# EAGLE design 0125-humidity-temp-sensor (EAGLE 9.6.2)
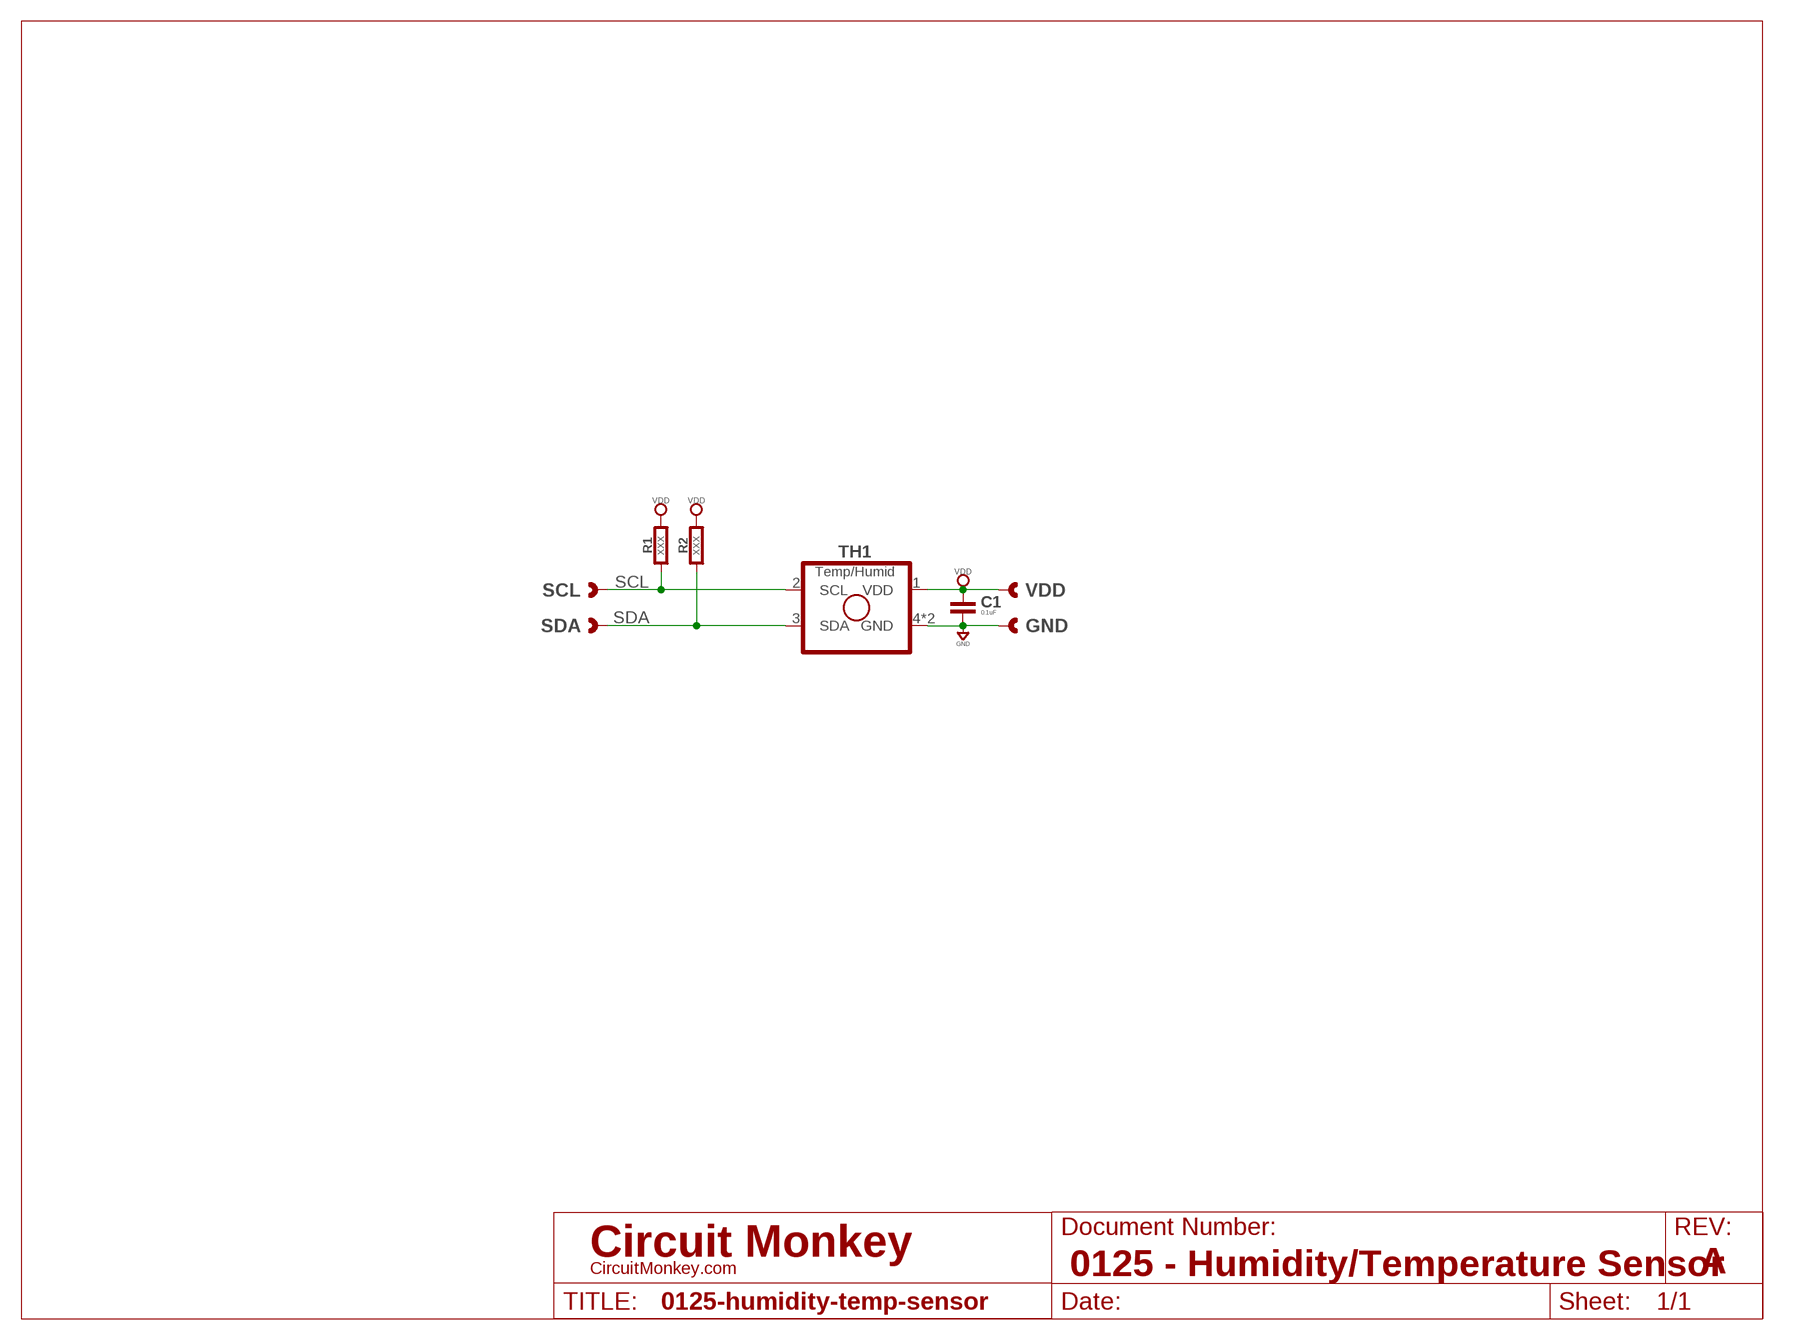
[diagram p0: schematic, sheet 1]
U$1 (LETTER_L-CIRCUITMONKEY): DOCUMENT_NUMBER: 0125 - Humidity/Temperature Sensor; REV: A

## Parts
C1  0.1uF  CAPACITOR0402  [0402-CAP]
GND  CAST-01X12.00MM  [CAST01-2.00MM]
R1  XXX  RESISTOR0402  [0402-RES]
R2  XXX  RESISTOR0402  [0402-RES]
SCL  CAST-01X12.00MM  [CAST01-2.00MM]
SDA  CAST-01X12.00MM  [CAST01-2.00MM]
TH1  Temp/Humid  I2C-SHTC3  [SHTC3]
VDD  CAST-01X12.00MM  [CAST01-2.00MM]

## Nets
GND: C1.2 GND.1 GND.P$1 GND.P$2 TH1.4(GND) TH1.PAD(GND)
SCL: R1.1 SCL.1 SCL.P$1 SCL.P$2 TH1.2(SCL)
SDA: R2.1 SDA.1 SDA.P$1 SDA.P$2 TH1.3(SDA)
VDD: C1.1 R1.2 R2.2 TH1.1(VDD) VDD.1 VDD.P$1 VDD.P$2

## Library data of the parts
C1 = rlc:CAPACITOR: Capacitor; COST01: 0.12; COST10: 0.09; COST100: 0.04
GND SCL SDA VDD = con-headers:CAST-01X1: Castelated Edge Hole Pad
R1 R2 = rlc:RESISTOR: Resistor; COST01: 0.10; COST10: 0.05; COST100: 0.02
TH1 = temperature:I2C: I2C Type Sensor; COST01: 2.50; COST100: 1.50; MFR: Sensiron; MPN: SHTC3

## Board
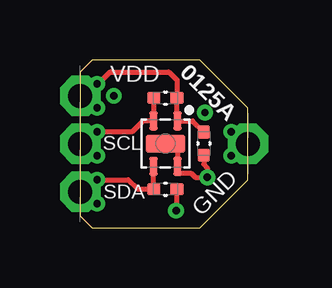
[diagram p1: board, top side]
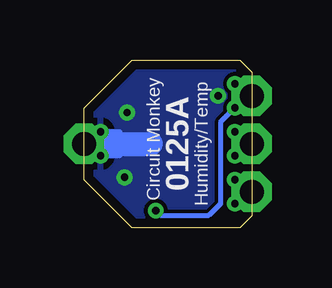
[diagram p2: board, bottom side, seen from below]

Size 7 x 7 mm. Coordinates in mm from the lower left corner, seen from the top.
Outline: 0.5,0 5,0 7,2 7,5 5,7 0.5,7 0,6.5 0,0.5 0.5,0
Copper layers (1*16): Top 0.0356mm / dielectric 1.5011mm / Bottom 0.0356mm
Design rules "OSH-CircuitMonkey": minimum track width 6mil, minimum drill 12mil, track to track 6mil, track to pad 6mil, pad to pad 6mil, via to via 6mil, smd to smd 6mil, copper to edge 15mil, drill to drill 6mil, minimum pad ring 7mil, minimum via ring 7mil, stop-mask expansion 3mil, vias tented up to drill 13mil, thermal gap 10mil

### Footprints (pad centres in the part's own frame; a part is rotated, then mirrored left to right if it is on the bottom)
0402-CAP = smd 0.559 x 0.508: 1 -0.483,0; 2 0.483,0
CAST01-2.00MM = drill 1 pad 1.7 octagon: 1 0,0 | drill 0.305: P$1 -0.7,0.5; P$2 -0.7,-0.5
0402-RES = smd 0.559 x 0.508: 1 -0.483,0; 2 0.483,0
SHTC3 = smd 0.8 x 0.35: 1 -0.95,0.5; 2 -0.95,-0.5; 3 0.95,-0.5; 4 0.95,0.5 | smd 0.75 x 1.65: PAD 0,0

### Placement (x,y rotation side)
C1  5.15,3.51 270 top
GND  7,3.5 0 top
R1  3.55,5.41 0 top
R2  3.55,1.61 0 top
SCL  0,3.5 180 top
SDA  0,1.5 180 top
TH1  3.55,3.51 270 top
VDD  0,5.5 180 top

### Tracks (layer width: path | path; a pad name or v marks a point on that pad's centre or on a via)
GND  (via drill 0.3)
  Top 0.2: GND.P$1 6.5,4 GND.1 6.5,3 GND.P$2 | C1.2 5.15,2.65 5.3,2.5 v5.3,2.1 4.8,2.1 4.64,2.26 4.15,2.26 4.05,2.36 TH1.4 4.05,3.41 3.95,3.51 TH1.PAD
  Bottom 0.2: GND.P$1 5.5,4 GND.1 5.5,3 GND.P$2
  Bottom 1: GND.1 4.2,3.5
  other vias: 5.2,4.8 1.4,5.5
  pour Bottom: 0.5,0 5,0 7,2 7,5 5,7 0.5,7 0,6.5 0,0.5
SCL
  Top 0.2: SCL.P$1 0.5,3 SCL.1 0.5,4 SCL.P$2 2.15,4 2.61,4.46 TH1.2 3.05,5.39 R1.1
SDA
  Top 0.2: SDA.P$1 0.5,1 SDA.1 0.5,2 SDA.P$2 2,2 2.39,1.61 R2.1 3.05,1.62 TH1.3
VDD  (via drill 0.3)
  Top 0.2: VDD.1 0.5,6 VDD.P$2 | VDD.1 0.5,5 VDD.P$1 | VDD.1 0.25,5.5 1.25,6.5 3.7,6.5 4.04,6.16 R1.2 4.04,4.47 TH1.1 4.69,4.46 C1.1 | v4,0.71 4.04,0.75 R2.2
  Bottom 0.2: VDD.1 0.2,5.5 1.3,4.4 1.3,1 1.79,0.51 3.8,0.51 v4,0.71

### Text on the board
tPlace: 0125A
bPlace: Humidity/Temp | 0125A | Circuit Monkey